# Altium project PCB_HV_INDICATOR_DELAROSA.PrjPcb
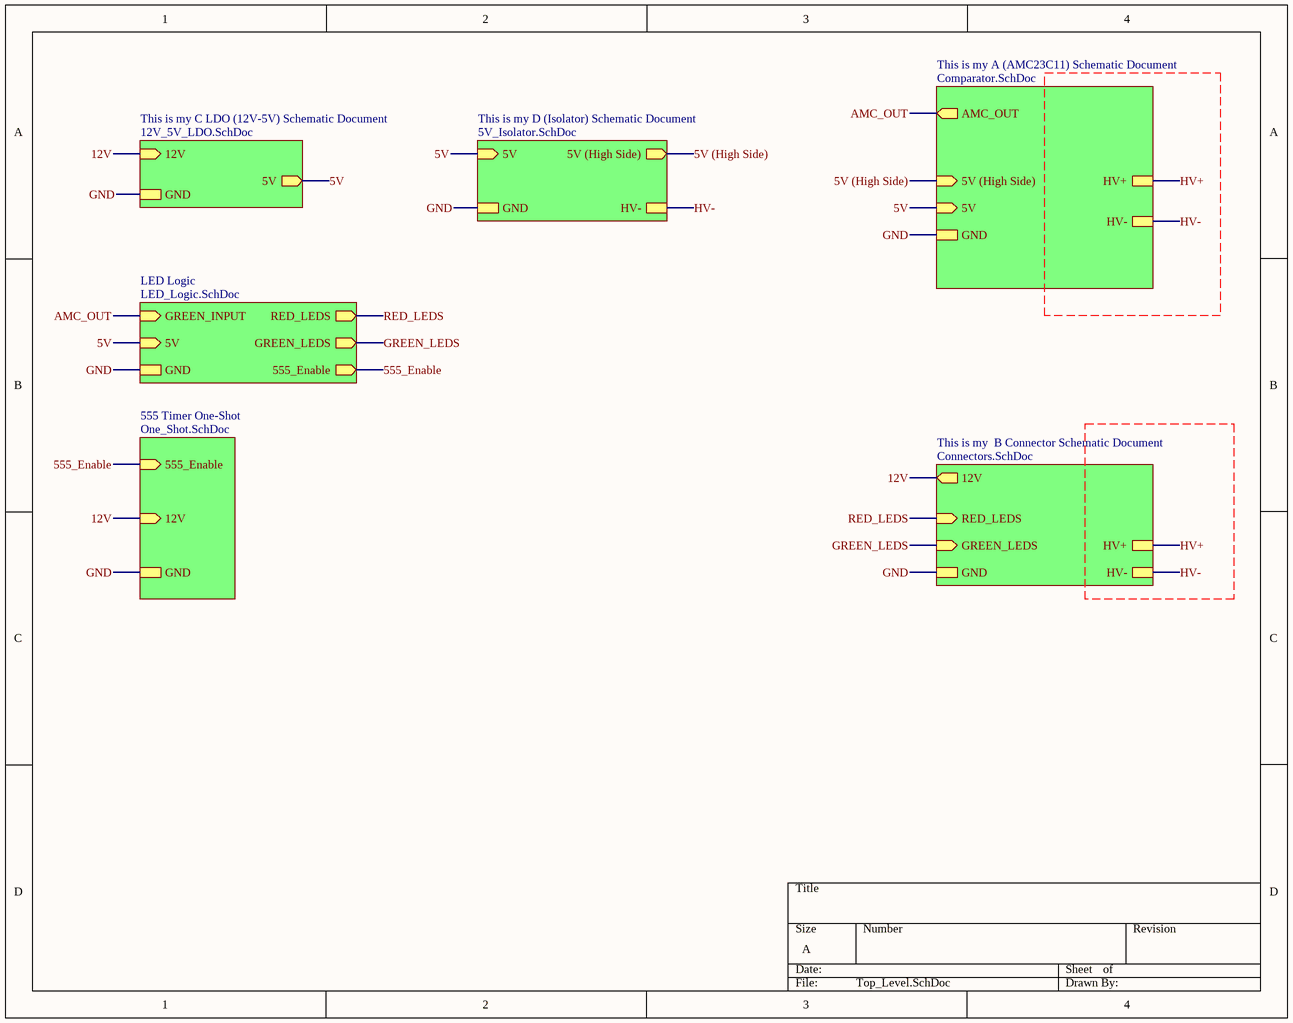
[diagram p0: Top_Level.SchDoc]
CAGE_CODE: ?????; CONTRACT_NUMBER: <CONTRACT NO>; DOC_NO_ASSY_DWG: <ASSY DWG NO>; DOC_NO_BOM: <BOM DOC NO>; DOC_NO_FAB_DWG: <FAB DWG NO>; DOC_NO_SCH_DWG: <SCH DWG NO>; PCB_2_DEC_TOL: +/-.01; PCB_3_DEC_TOL: +/-.010; PCB_ANG_TOL: +/-1/2; PCB_ASSEMBLY_NO: <PCB ASSY NO>; PCB_CHECKER: - -----; PCB_CHECKER_APP_DATE: --/--/----; PCB_DESIGNER: - -----; PCB_DESIGNER_APP_DATE: --/--/----; PCB_DWG_NO: <PCB DWG NO>; PCB_ENGINEER: - -----; PCB_ENGINEER_APP_DATE: --/--/----; PCB_PART_NUMBER: <PCB PN>; PCB_REV: A; SCH_REV: A
7 sheets, 40 parts. Net scope: hierarchical (ports join the sheet entries above them; power ports are global).
Board file: PCB_INDICATOR_DELAROSA_REV2_.PcbDoc
Sheets:
  Top_Level.SchDoc
    This is my A (AMC23C11) Schematic Document = Comparator.SchDoc
    This is my  B Connector Schematic Document = Connectors.SchDoc
    This is my C LDO (12V-5V) Schematic Document = 12V_5V_LDO.SchDoc
    This is my D (Isolator) Schematic Document = 5V_Isolator.SchDoc
    LED Logic = LED_Logic.SchDoc
    555 Timer One-Shot = One_Shot.SchDoc

## Sheet Top_Level.SchDoc
size A

### Sub-sheets
555 Timer One-Shot = One_Shot.SchDoc: 555_Enable (in), 12V (in), GND
LED Logic = LED_Logic.SchDoc: GREEN_INPUT (in), 5V (in), RED_LEDS (out), GREEN_LEDS (out), GND, 555_Enable (out)
This is my  B Connector Schematic Document = Connectors.SchDoc: 12V (out), HV-, RED_LEDS (in), GREEN_LEDS (in), GND, HV+
This is my A (AMC23C11) Schematic Document = Comparator.SchDoc: 5V (High Side) (in), 5V (in), HV-, AMC_OUT (out), GND, HV+
This is my C LDO (12V-5V) Schematic Document = 12V_5V_LDO.SchDoc: 12V (in), 5V (out), GND
This is my D (Isolator) Schematic Document = 5V_Isolator.SchDoc: 5V (in), GND, 5V (High Side) (out), HV-

### Nets
GND: sheet This is my A (AMC23C11) Schematic Document/GND, sheet This is my  B Connector Schematic Document/GND, sheet This is my C LDO (12V-5V) Schematic Document/GND, sheet This is my D (Isolator) Schematic Document/GND, sheet LED Logic/GND, sheet 555 Timer One-Shot/GND
5V: sheet This is my A (AMC23C11) Schematic Document/5V, sheet This is my C LDO (12V-5V) Schematic Document/5V, sheet This is my D (Isolator) Schematic Document/5V, sheet LED Logic/5V
5V (High Side): sheet This is my A (AMC23C11) Schematic Document/5V (High Side), sheet This is my D (Isolator) Schematic Document/5V (High Side)
12V: sheet This is my  B Connector Schematic Document/12V, sheet This is my C LDO (12V-5V) Schematic Document/12V, sheet 555 Timer One-Shot/12V
555_Enable: sheet LED Logic/555_Enable, sheet 555 Timer One-Shot/555_Enable
AMC_OUT: sheet This is my A (AMC23C11) Schematic Document/AMC_OUT, sheet LED Logic/GREEN_INPUT
GREEN_LEDS: sheet This is my  B Connector Schematic Document/GREEN_LEDS, sheet LED Logic/GREEN_LEDS
HV+: sheet This is my A (AMC23C11) Schematic Document/HV+, sheet This is my  B Connector Schematic Document/HV+
HV-: sheet This is my A (AMC23C11) Schematic Document/HV-, sheet This is my  B Connector Schematic Document/HV-, sheet This is my D (Isolator) Schematic Document/HV-
RED_LEDS: sheet This is my  B Connector Schematic Document/RED_LEDS, sheet LED Logic/RED_LEDS

## Sheet Comparator.SchDoc
size A
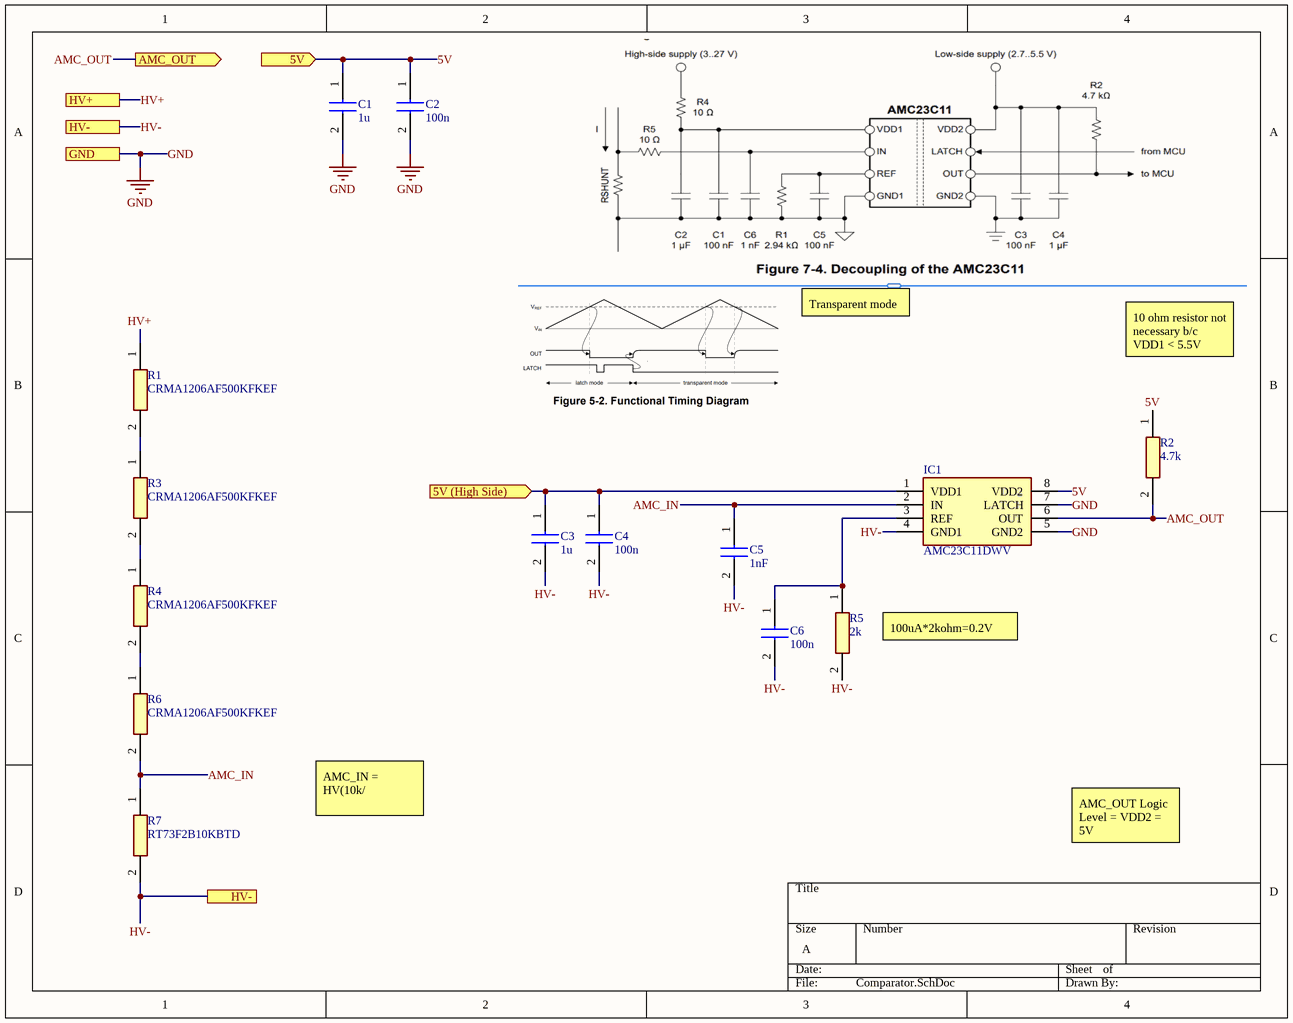
[diagram p1: Comparator.SchDoc]

### Parts
C1  1u  [CAPC2012X145N]
C2  100n  [CAPC2012X147N]
C3  1u  [CAPC2012X145N]
C4  100n  [CAPC2012X147N]
C5  1nF  [C1210]
C6  100n  [CAPC2012X147N]
IC1  AMC23C11DWV  [SOIC127P1150X280-8N]
R1  CRMA1206AF500KFKEF  [RESC3216X74N]
R2  4.7k  [RESC2012X65N]
R3  CRMA1206AF500KFKEF  [RESC3216X74N]
R4  CRMA1206AF500KFKEF  [RESC3216X74N]
R5  2k  [ERJP06D1000V]
R6  CRMA1206AF500KFKEF  [RESC3216X74N]
R7  RT73F2B10KBTD  [RESC3216X70N]

### Ports
5V (High Side) (in), 5V (in), AMC_OUT (out), GND, HV+, HV-

### Nets
GND: C1.2 C2.2 IC1.5(GND2) IC1.7(LATCH) ; port GND
5V: C1.1 C2.1 IC1.8(VDD2) R2.1 ; port 5V
5V (High Side): C3.1 C4.1 IC1.1(VDD1) ; port 5V (High Side)
AMC_IN: C5.1 IC1.2(IN) R6.2 R7.1
AMC_OUT: IC1.6(OUT) R2.2 ; port AMC_OUT
HV+: R1.1 ; port HV+
HV-: C3.2 C4.2 C5.2 C6.2 IC1.4(GND1) R5.2 R7.2 ; port HV-
NetC6_1: C6.1 IC1.3(REF) R5.1
NetR1_2: R1.2 R3.1
NetR3_2: R3.2 R4.1
NetR4_2: R4.2 R6.1

### Notes on the sheet
- Transparent mode
- 10 ohm resistor not necessary b/c VDD1 < 5.5V
- (near R5) 100uA*2kohm=0.2V
- AMC_IN = HV(10k/
- AMC_OUT Logic Level = VDD2 = 5V

### Library data of the parts
C1 C3 = KGM21AV51H105ZU: Capacitor; Manufacturer_Name: Kyocera AVX; Datasheet Link: https://www.mouser.com/datasheet/2/40/KGM_Y5V-3223189.pdf; Height: 1.45mm; Manufacturer_Part_Number: KGM21AV51H105ZU
C2 C4 C6 = KGF21BR71H104KT: Capacitor; Manufacturer_Name: Kyocera AVX; Datasheet Link: https://www.mouser.fr/datasheet/2/40/KGF-3223650.pdf; Height: 1.47mm; Manufacturer_Part_Number: KGF21BR71H104KT; Mouser Part Number: 581-KGF21BR71H104KT; Mouser Price/Stock: https://www.mouser.co.uk/ProductDetail/KYOCERA-AVX/KGF21BR71H104KT?qs=Jm2GQyTW%2FbjYyKCvVWAEOw%3D%3D; Arrow Part Number: KGF21BR71H104KT; Arrow Price/Stock: https://www.arrow.com/en/products/kgf21br71h104kt/avx?utm_currency=USD&region=nac
C5 = C1210C102JDGACAUTO: Capacitor; Manufacturer_Name: Yageo Group; Datasheet Link: https://www.yageogroup.com/content/datasheet/asset/file/KEM_C1080_C0G_HV_AUTO_SMD; Manufacturer_Part_Number: C1210C102JDGACAUTO; Mouser Part Number: 80-C1210C102JDGAUTO; Mouser Price/Stock: https://www.mouser.co.uk/ProductDetail/KEMET/C1210C102JDGACAUTO?qs=f9yNj16SXrIz1%252BjZlRLS%2FQ%3D%3D
IC1 = AMC23C11DWV: Integrated Circuit; Manufacturer_Name: Texas Instruments; Datasheet Link: https://www.ti.com/lit/ds/symlink/amc23c11.pdf; Height: 2.8mm; Manufacturer_Part_Number: AMC23C11DWV; Mouser Part Number: 595-AMC23C11DWV; Mouser Price/Stock: https://www.mouser.co.uk/ProductDetail/Texas-Instruments/AMC23C11DWV?qs=By6Nw2ByBD0b%2FD7l%2FEQWqQ%3D%3D; Arrow Part Number: AMC23C11DWV; Arrow Price/Stock: https://www.arrow.com/en/products/amc23c11dwv/texas-instruments?utm_currency=USD&region=nac
R1 R3 R4 R6 = CRMA1206AF500KFKEF: Resistor; Manufacturer_Name: Vishay; Datasheet Link: https://www.vishay.com/docs/68043/crma.pdf; Height: 0.74mm; Manufacturer_Part_Number: CRMA1206AF500KFKEF; Mouser Part Number: 71-CRMA1206AF500KFKF; Mouser Price/Stock: https://www.mouser.co.uk/ProductDetail/Vishay-Techno/CRMA1206AF500KFKEF?qs=1mbolxNpo8cDdncTsqghaQ%3D%3D; Arrow Part Number: CRMA1206AF500KFKEF; Arrow Price/Stock: https://www.arrow.com/en/products/crma1206af500kfkef/vishay?region=nac
R2 = CRG0805J4K7: Resistor; Manufacturer_Name: TE Connectivity; Datasheet Link: https://www.te.com/commerce/DocumentDelivery/DDEController?Action=srchrtrv&DocNm=1773204&DocType=Data%20Sheet&DocLang=English&PartCntxt=1623378-1&DocFormat=pdf; Height: 0.65mm; Manufacturer_Part_Number: CRG0805J4K7; Mouser Part Number: 279-CRG0805J4K7; Mouser Price/Stock: https://www.mouser.co.uk/ProductDetail/TE-Connectivity-Holsworthy/CRG0805J4K7?qs=8G8kQhBkhGgMmCk94lgNPw%3D%3D; Arrow Part Number: CRG0805J4K7; Arrow Price/Stock: https://www.arrow.com/en/products/crg0805j4k7/te-connectivity
R5 = ERJ-P06F2001V: Resistor; Manufacturer_Name: Panasonic; Datasheet Link: http://industrial.panasonic.com/cdbs/www-data/pdf/RDA0000/AOA0000C102.pdf; Height: 0.7mm; Manufacturer_Part_Number: ERJ-P06F2001V; Mouser Part Number: 667-ERJ-P06F2001V; Mouser Price/Stock: https://www.mouser.co.uk/ProductDetail/Panasonic/ERJ-P06F2001V?qs=iIVTEDlrHA33HmjCRTb3vw%3D%3D; Arrow Part Number: ERJ-P06F2001V; Arrow Price/Stock: https://www.arrow.com/en/products/erjp06f2001v/panasonic?region=nac
R7 = RT73F2B10KBTD: Resistor; Manufacturer_Name: TE Connectivity; Datasheet Link: https://www.te.com/commerce/DocumentDelivery/DDEController?Action=showdoc&DocId=Data+Sheet%7F1773450%7FA1%7Fpdf%7FEnglish%7FENG_DS_1773450_A1.pdf%7FCAT-F52-R; Height: 0.7mm; Manufacturer_Part_Number: RT73F2B10KBTD

## Sheet Connectors.SchDoc
size A
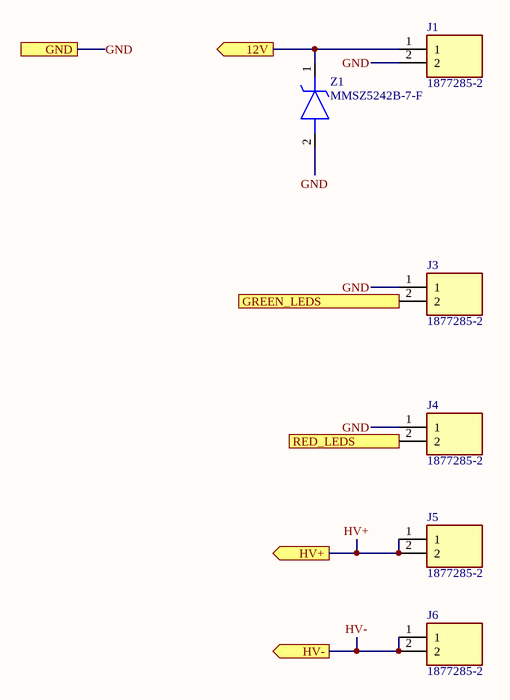
[diagram p2: Connectors.SchDoc]

### Parts
J1  1877285-2  [18772852]
J3  1877285-2  [18772852]
J4  1877285-2  [18772852]
J5  1877285-2  [18772852]
J6  1877285-2  [18772852]
Z1  MMSZ5242B-7-F  [SOD3716X145N]

### Ports
12V (out), GND, GREEN_LEDS (in), HV+ (out), HV- (out), RED_LEDS (in)

### Nets
GND: J1.2 J3.1 J4.1 Z1.2(A) ; port GND
12V: J1.1 Z1.1(K) ; port 12V
GREEN_LEDS: J3.2 ; port GREEN_LEDS
HV+: J5.1 J5.2 ; port HV+
HV-: J6.1 J6.2 ; port HV-
RED_LEDS: J4.2 ; port RED_LEDS

### Library data of the parts
J1 J3-J6 = 1877285-2: Connector; Manufacturer_Name: TE Connectivity; Datasheet Link: https://www.te.com/commerce/DocumentDelivery/DDEController?Action=srchrtrv&DocNm=7-1773458-5_ECONOMY_POWER_QRG&DocType=Data%20Sheet&DocLang=English&PartCntxt=1877285-2&DocFormat=pdf; Height: 12mm; Manufacturer_Part_Number: 1877285-2; Mouser Part Number: 571-1877285-2; Mouser Price/Stock: https://www.mouser.co.uk/ProductDetail/TE-Connectivity/1877285-2?qs=ka3zfMQDmFlAIZq5pDt5JA%3D%3D; Arrow Part Number: 1877285-2; Arrow Price/Stock: https://www.arrow.com/en/products/1877285-2/te-connectivity?region=europe
Z1 = MMSZ5242B-7-F: Zener Diode; Manufacturer_Name: Diodes Incorporated; Datasheet Link: https://www.diodes.com//assets/Datasheets/ds18010.pdf; Height: 1.45mm; Manufacturer_Part_Number: MMSZ5242B-7-F; Mouser Part Number: 621-MMSZ5242B-F; Mouser Price/Stock: https://www.mouser.co.uk/ProductDetail/Diodes-Incorporated/MMSZ5242B-7-F?qs=q1%252B6u8LlB5fEENM1dXHh%252Bg%3D%3D; Arrow Part Number: MMSZ5242B-7-F; Arrow Price/Stock: https://www.arrow.com/en/products/mmsz5242b-7-f/diodes-incorporated?utm_currency=USD&region=nac

## Sheet 12V_5V_LDO.SchDoc
size A
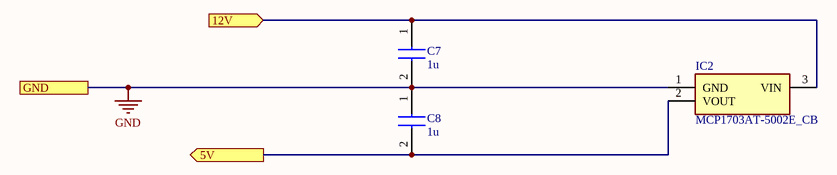
[diagram p3: 12V_5V_LDO.SchDoc]

### Parts
C7  1u  [CAPC2012X145N]
C8  1u  [CAPC2012X145N]
IC2  MCP1703AT-5002E_CB  [SOT95P255X145-3N]

### Ports
5V (out), 12V (in), GND

### Nets
GND: C7.2 C8.1 IC2.1(GND) ; port GND
5V: C8.2 IC2.2(VOUT) ; port 5V
12V: C7.1 IC2.3(VIN) ; port 12V

### Library data of the parts
C7 C8 = KGM21AV51H105ZU: as C1 on sheet Comparator; Datasheet Link: https://www.mouser.com/datasheet/2/40/KGM_Y5V-3223189.pdf; Height: 1.45mm; Manufacturer_Part_Number: KGM21AV51H105ZU
IC2 = MCP1703AT-5002E_CB: Integrated Circuit; Manufacturer_Name: Microchip; Manufacturer_Part_Number: MCP1703AT-5002E/CB; Datasheet Link: http://uk.rs-online.com/web/p/products/7709511; Height: 1.45mm; Mouser Part Number: 579-MCP1703AT5002ECB; Mouser Price/Stock: https://www.mouser.co.uk/ProductDetail/Microchip-Technology/MCP1703AT-5002E-CB?qs=PZkJWYMe7lfGlNu7PCEqfg%3D%3D; Arrow Part Number: MCP1703AT-5002E/CB; Arrow Price/Stock: https://www.arrow.com/en/products/mcp1703at-5002ecb/microchip-technology?utm_currency=USD&region=nac

## Sheet 5V_Isolator.SchDoc
size A
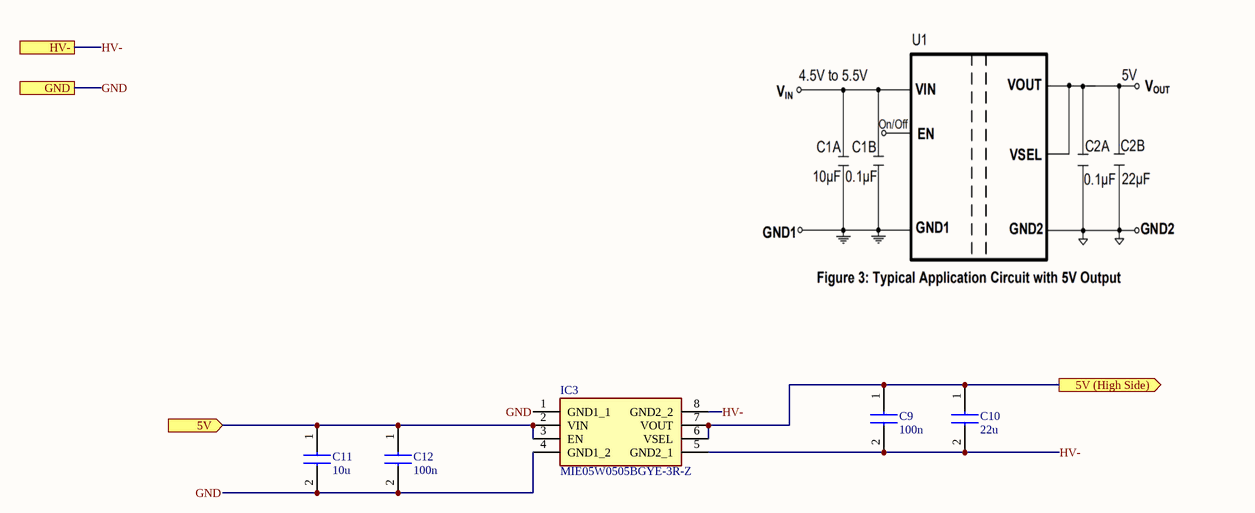
[diagram p4: 5V_Isolator.SchDoc]

### Parts
C9  100n  [CAPC2012X147N]
C10  22u  [CAPC2012X145N]
C11  10u  [GRM21BR60J226ME39L]
C12  100n  [CAPC2012X147N]
IC3  MIE05W0505BGYE-3R-Z  [SOIC127P1030X265-8N]

### Ports
5V (High Side) (out), 5V (in), GND, HV-

### Nets
GND: C11.2 C12.2 IC3.1(GND1_1) IC3.4(GND1_2) ; port GND
5V: C11.1 C12.1 IC3.2(VIN) IC3.3(EN) ; port 5V
5V (High Side): C9.1 C10.1 IC3.6(VSEL) IC3.7(VOUT) ; port 5V (High Side)
HV-: C9.2 C10.2 IC3.5(GND2_1) IC3.8(GND2_2) ; port HV-

### Library data of the parts
C9 C12 = KGF21BR71H104KT: as C2 on sheet Comparator; Datasheet Link: https://www.mouser.fr/datasheet/2/40/KGF-3223650.pdf; Height: 1.47mm; Manufacturer_Part_Number: KGF21BR71H104KT; Mouser Part Number: 581-KGF21BR71H104KT; Mouser Price/Stock: https://www.mouser.co.uk/ProductDetail/KYOCERA-AVX/KGF21BR71H104KT?qs=Jm2GQyTW%2FbjYyKCvVWAEOw%3D%3D; Arrow Part Number: KGF21BR71H104KT; Arrow Price/Stock: https://www.arrow.com/en/products/kgf21br71h104kt/avx?utm_currency=USD&region=nac
C10 = GXT21BR61C226ME13L: Capacitor; Manufacturer_Name: Murata Electronics; Datasheet Link: https://www.murata.com/en-global/products/productdetail?partno=GXT21BR61C226ME13%23; Height: 1.45mm; Manufacturer_Part_Number: GXT21BR61C226ME13L
C11 = GRM21BR61H106KE43L: Capacitor; Manufacturer_Name: Murata Electronics; Datasheet Link: https://search.murata.co.jp/Ceramy/image/img/A01X/G101/ENG/GRM21BR61H106KE43-01A.pdf; Height: 1.45mm; Manufacturer_Part_Number: GRM21BR61H106KE43L; Mouser Part Number: 81-GRM21BR61H106KE3L; Mouser Price/Stock: https://www.mouser.co.uk/ProductDetail/Murata-Electronics/GRM21BR61H106KE43L?qs=lYGu3FyN48cBZlIduWKclg%3D%3D; Arrow Part Number: GRM21BR61H106KE43L; Arrow Price/Stock: https://www.arrow.com/en/products/grm21br61h106ke43l/murata-manufacturing?utm_currency=USD&region=europe
IC3 = MIE05W0505BGYE-3R-Z: Integrated Circuit; Manufacturer_Name: Monolithic Power Systems (MPS); Datasheet Link: https://www.monolithicpower.com/en/documentview/productdocument/index/version/2/document_type/Datasheet/lang/en/sku/MIE05W0505BGYE/document_id/11798/; Height: 2.65mm; Manufacturer_Part_Number: MIE05W0505BGYE-3R-Z

## Sheet LED_Logic.SchDoc
size A
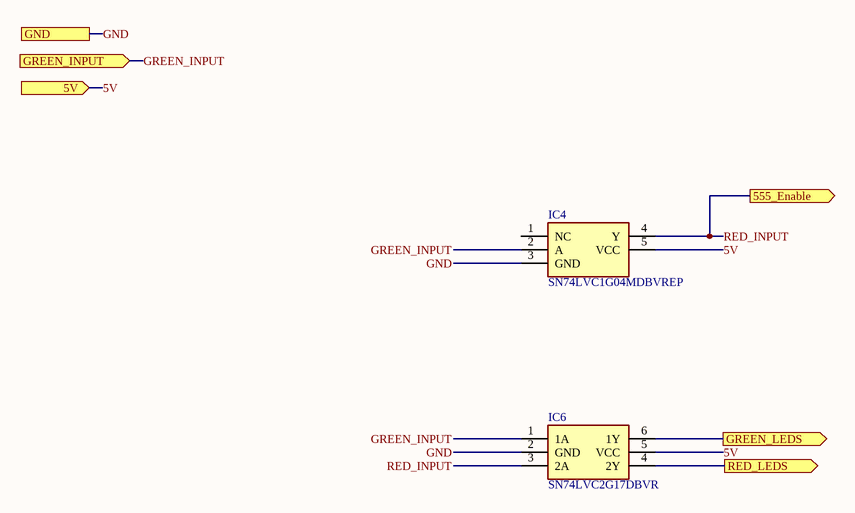
[diagram p5: LED_Logic.SchDoc]

### Parts
IC4  SN74LVC1G04MDBVREP  [SOT95P280X145-5N]
IC6  SN74LVC2G17DBVR  [SOT95P280X145-6N]

### Ports
5V (in), 555_Enable (out), GND, GREEN_INPUT (in), GREEN_LEDS (out), RED_LEDS (out)

### Nets
GND: IC4.3(GND) IC6.2(GND) ; port GND
5V: IC4.5(VCC) IC6.5(VCC) ; port 5V
GREEN_INPUT: IC4.2(A) IC6.1(1A) ; port GREEN_INPUT  [project net AMC_OUT]
GREEN_LEDS: IC6.6(1Y) ; port GREEN_LEDS
RED_INPUT: IC4.4(Y) IC6.3(2A) ; port 555_Enable  [project net 555_Enable]
RED_LEDS: IC6.4(2Y) ; port RED_LEDS

Not connected (* = marked no-connect by the designer): IC4 1(NC)

### Library data of the parts
IC4 = SN74LVC1G04MDBVREP: Integrated Circuit; Manufacturer_Name: Texas Instruments; Datasheet Link: http://www.ti.com/lit/gpn/sn74lvc1g04-ep; Height: 1.45mm; Manufacturer_Part_Number: SN74LVC1G04MDBVREP; Mouser Part Number: 595-SN74LVC04MDBVREP; Mouser Price/Stock: https://www.mouser.co.uk/ProductDetail/Texas-Instruments/SN74LVC1G04MDBVREP?qs=l4wu3mKjyflWQOlEvZuvmw%3D%3D; Arrow Part Number: SN74LVC1G04MDBVREP; Arrow Price/Stock: https://www.arrow.com/en/products/sn74lvc1g04mdbvrep/texas-instruments?utm_currency=USD&region=nac
IC6 = SN74LVC2G17DBVR: Integrated Circuit; Manufacturer_Name: Texas Instruments; Datasheet Link: http://www.ti.com/lit/gpn/sn74lvc2g17; Height: 1.45mm; Manufacturer_Part_Number: SN74LVC2G17DBVR; Mouser Part Number: 595-SN74LVC2G17DBVR; Mouser Price/Stock: https://www.mouser.co.uk/ProductDetail/Texas-Instruments/SN74LVC2G17DBVR?qs=X1HXWTtiZ0RnstCufGEJxQ%3D%3D; Arrow Part Number: SN74LVC2G17DBVR; Arrow Price/Stock: https://www.arrow.com/en/products/sn74lvc2g17dbvr/texas-instruments?utm_currency=USD&region=nac

## Sheet One_Shot.SchDoc
size A
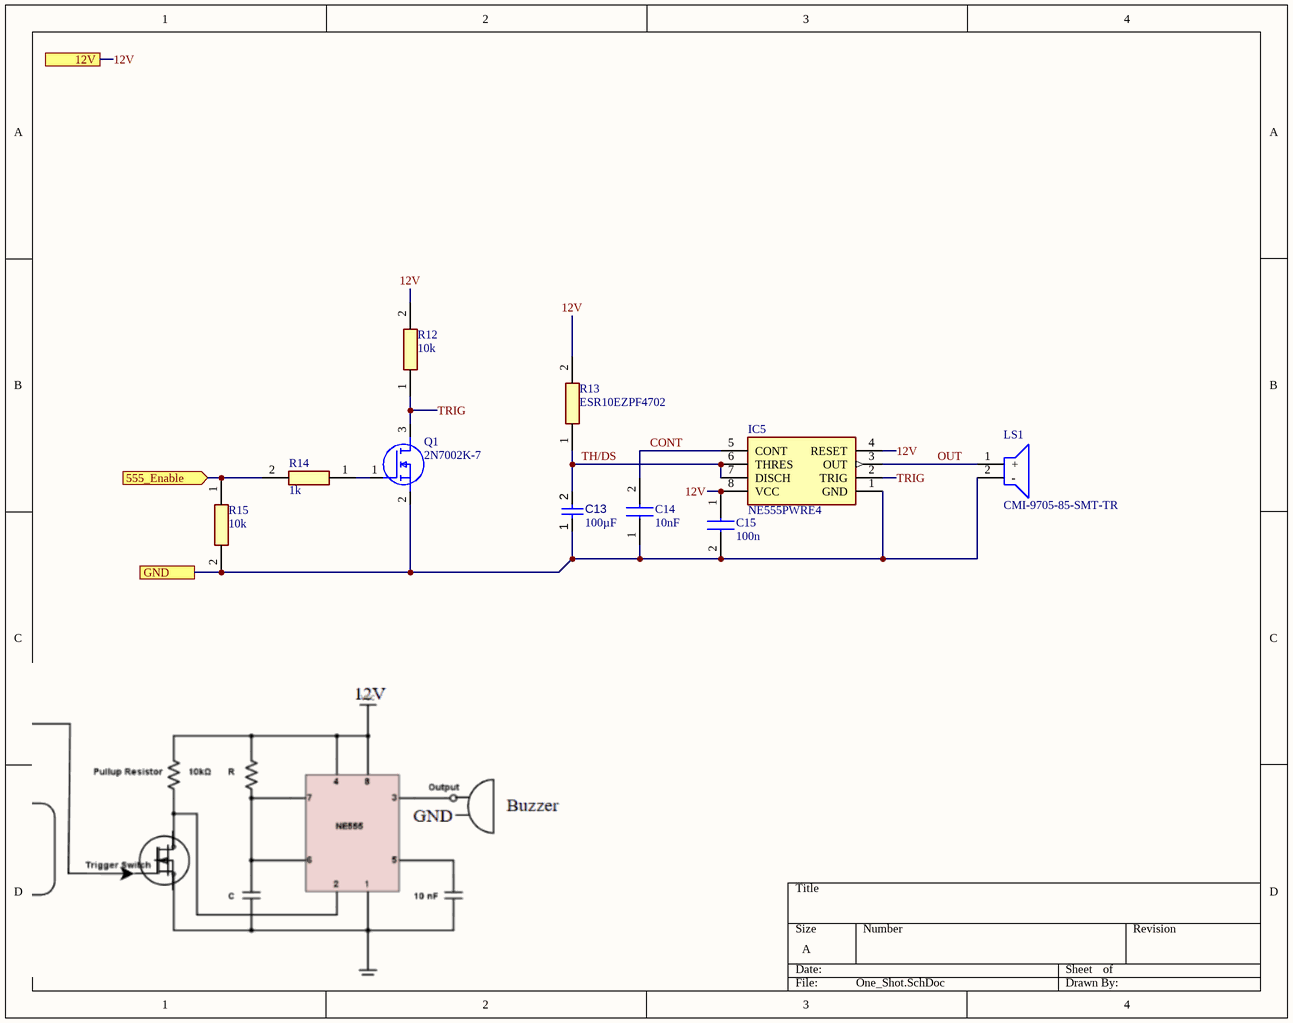
[diagram p6: One_Shot.SchDoc]

### Parts
C13  value 100µF  [CAPC0805(2012)145_L]  (hidden comment: Capacitor 100µF +/-20% 6.3V 0805)
C14  10nF  [C0805]
C15  100n  [CAPC2012X147N]
IC5  NE555PWRE4  [SOP65P640X120-8N]
LS1  CMI-9705-85-SMT-TR  [CMI970585SMTTR]
Q1  2N7002K-7  [SOT96P240X115-3N]
R12  10k  [RESC2012X60N]
R13  ESR10EZPF4702  [RESC2012X65N]
R14  1k  [RESC2013X65N]
R15  10k  [RESC2012X60N]

### Ports
12V, 555_Enable (in), GND

### Nets
GND: C13.1 C14.1 C15.2 IC5.1(GND) LS1.2(-) Q1.2(S) R15.2 ; port GND
12V: C15.1 IC5.4(RESET) IC5.8(VCC) R12.2 R13.2 ; port 12V
555_Enable: R14.2 R15.1 ; port 555_Enable
CONT: C14.2 IC5.5(CONT)
OUT: IC5.3(OUT) LS1.1(+)
TH/DS: C13.2 IC5.6(THRES) IC5.7(DISCH) R13.1
TRIG: IC5.2(TRIG) Q1.3(D) R12.1
NetQ1_1: Q1.1(G) R14.1

### Library data of the parts
C13 = CMP-001-00054-4: Chip Capacitor, 100µF +/-20%, 6.3V, 0805, Thickness 1.45 mm; Tolerance: 10%; Min Operating Temperature: -55°C; Max Operating Temperature: 85°C; Pins: 2; Mounting Technology: SMT; Case/Package: 0805; Voltage Rating: 6.3V
C14 = C0805C103F1GACAUTO: Capacitor; Manufacturer_Name: Yageo Group; Datasheet Link: https://www.yageogroup.com/content/datasheet/asset/file/KEM_C1022_C0G_AUTO_SMD; Height: 1.1mm; Manufacturer_Part_Number: C0805C103F1GACAUTO; Mouser Part Number: 80-C0805C103F1GAUTO; Mouser Price/Stock: https://www.mouser.co.uk/ProductDetail/KEMET/C0805C103F1GACAUTO?qs=SKxV22VtNmdH%252BCKBcUCnZA%3D%3D; Arrow Part Number: C0805C103F1GACAUTO; Arrow Price/Stock: https://www.arrow.com/en/products/c0805c103f1gacauto/kemet-corporation?utm_currency=USD&region=nac
C15 = KGF21BR71H104KT: as C2 on sheet Comparator; Datasheet Link: https://www.mouser.fr/datasheet/2/40/KGF-3223650.pdf; Height: 1.47mm; Manufacturer_Part_Number: KGF21BR71H104KT; Mouser Part Number: 581-KGF21BR71H104KT; Mouser Price/Stock: https://www.mouser.co.uk/ProductDetail/KYOCERA-AVX/KGF21BR71H104KT?qs=Jm2GQyTW%2FbjYyKCvVWAEOw%3D%3D; Arrow Part Number: KGF21BR71H104KT; Arrow Price/Stock: https://www.arrow.com/en/products/kgf21br71h104kt/avx?utm_currency=USD&region=nac
IC5 = NE555PWRE4: Integrated Circuit; Manufacturer_Name: Texas Instruments; Datasheet Link: http://www.ti.com/lit/ds/symlink/ne555.pdf; Height: 1.2mm; Manufacturer_Part_Number: NE555PWRE4; Mouser Part Number: 595-NE555PWRE4; Mouser Price/Stock: https://www.mouser.co.uk/ProductDetail/Texas-Instruments/NE555PWRE4?qs=rLYyFdxB%2Fmr6qUodVTnTjw%3D%3D; Arrow Part Number: NE555PWRE4; Arrow Price/Stock: https://www.arrow.com/en/products/ne555pwre4/texas-instruments
LS1 = CMI-9705-85-SMT-TR: Loudspeaker or Buzzer; Manufacturer_Name: Same Sky; Datasheet Link: https://www.sameskydevices.com/product/resource/CMI-9705-85-SMT-TR.pdf; Height: 5.5mm; Manufacturer_Part_Number: CMI-9705-85-SMT-TR; Mouser Part Number: 490-CMI-9705-85SMTTR; Mouser Price/Stock: https://www.mouser.co.uk/ProductDetail/CUI-Devices/CMI-9705-85-SMT-TR?qs=P1JMDcb91o4Wun0lW9vptg%3D%3D; Arrow Part Number: CMI-9705-85-SMT-TR; Arrow Price/Stock: https://www.arrow.com/en/products/cmi-9705-85-smt-tr/cui-devices?region=nac
Q1 = 2N7002K-7: MOSFET (N-Channel); Manufacturer_Name: Diodes Incorporated; Description: N-CHANNEL ENHANCEMENT MODE MOSFET; Datasheet Link: https://www.diodes.com//assets/Datasheets/2N7002K.pdf; Height: 1.15mm; Manufacturer_Part_Number: 2N7002K-7; Mouser Part Number: 621-2N7002K-7; Mouser Price/Stock: https://www.mouser.co.uk/ProductDetail/Diodes-Incorporated/2N7002K-7?qs=rGAXPo9uwV0%2Fp9r5KJ7huA%3D%3D; Arrow Part Number: 2N7002K-7; Arrow Price/Stock: https://www.arrow.com/en/products/2n7002k-7/diodes-incorporated.html?utm_currency=USD&region=nac
R12 R15 = RV0805JR-0710KL: Resistor; Manufacturer_Name: Yageo Group; Datasheet Link: https://www.mouser.in/new/yageo/yageo-rv-resistors/; Height: 0.6mm; Manufacturer_Part_Number: RV0805JR-0710KL
R13 = ESR10EZPF4702: Resistor; Manufacturer_Name: ROHM Semiconductor; Datasheet Link: http://uk.rs-online.com/web/p/products/1674355; Height: 0.65mm; Manufacturer_Part_Number: ESR10EZPF4702; Mouser Part Number: 755-ESR10EZPF4702; Mouser Price/Stock: https://www.mouser.com/Search/Refine.aspx?Keyword=755-ESR10EZPF4702
R14 = WCR0805LF1001FPLT: Resistor; Manufacturer_Name: TT Electronics; Datasheet Link: https://g.componentsearchengine.com/Datasheets/1/WCR0805LF1001FPLT.pdf; Height: 0.65mm; Manufacturer_Part_Number: WCR0805LF1001FPLT; Mouser Part Number: 66-WCR0805LF1001FPLT; Mouser Price/Stock: https://www.mouser.com/Search/Refine.aspx?Keyword=66-WCR0805LF1001FPLT

## Nets that join several sheets
GND: Comparator (C1.2 C2.2 IC1.5 IC1.7), Connectors (J1.2 J3.1 J4.1 Z1.2), 12V_5V_LDO (C7.2 C8.1 IC2.1), 5V_Isolator (C11.2 C12.2 IC3.1 IC3.4), LED_Logic (IC4.3 IC6.2), One_Shot (7 pins)
5V: Comparator (C1.1 C2.1 IC1.8 R2.1), 12V_5V_LDO (C8.2 IC2.2), 5V_Isolator (C11.1 C12.1 IC3.2 IC3.3), LED_Logic (IC4.5 IC6.5)
5V (High Side): Comparator (C3.1 C4.1 IC1.1), 5V_Isolator (C9.1 C10.1 IC3.6 IC3.7)
12V: Connectors (J1.1 Z1.1), 12V_5V_LDO (C7.1 IC2.3), One_Shot (5 pins)
555_Enable: LED_Logic (IC4.4 IC6.3), One_Shot (R14.2 R15.1)
AMC_OUT: Comparator (IC1.6 R2.2), LED_Logic (IC4.2 IC6.1)
GREEN_LEDS: Connectors (J3.2), LED_Logic (IC6.6)
HV+: Comparator (R1.1), Connectors (J5.1 J5.2)
HV-: Comparator (7 pins), Connectors (J6.1 J6.2), 5V_Isolator (C9.2 C10.2 IC3.5 IC3.8)
RED_LEDS: Connectors (J4.2), LED_Logic (IC6.4)